# EAGLE schematic ledring_nocxn (EAGLE 6.4)
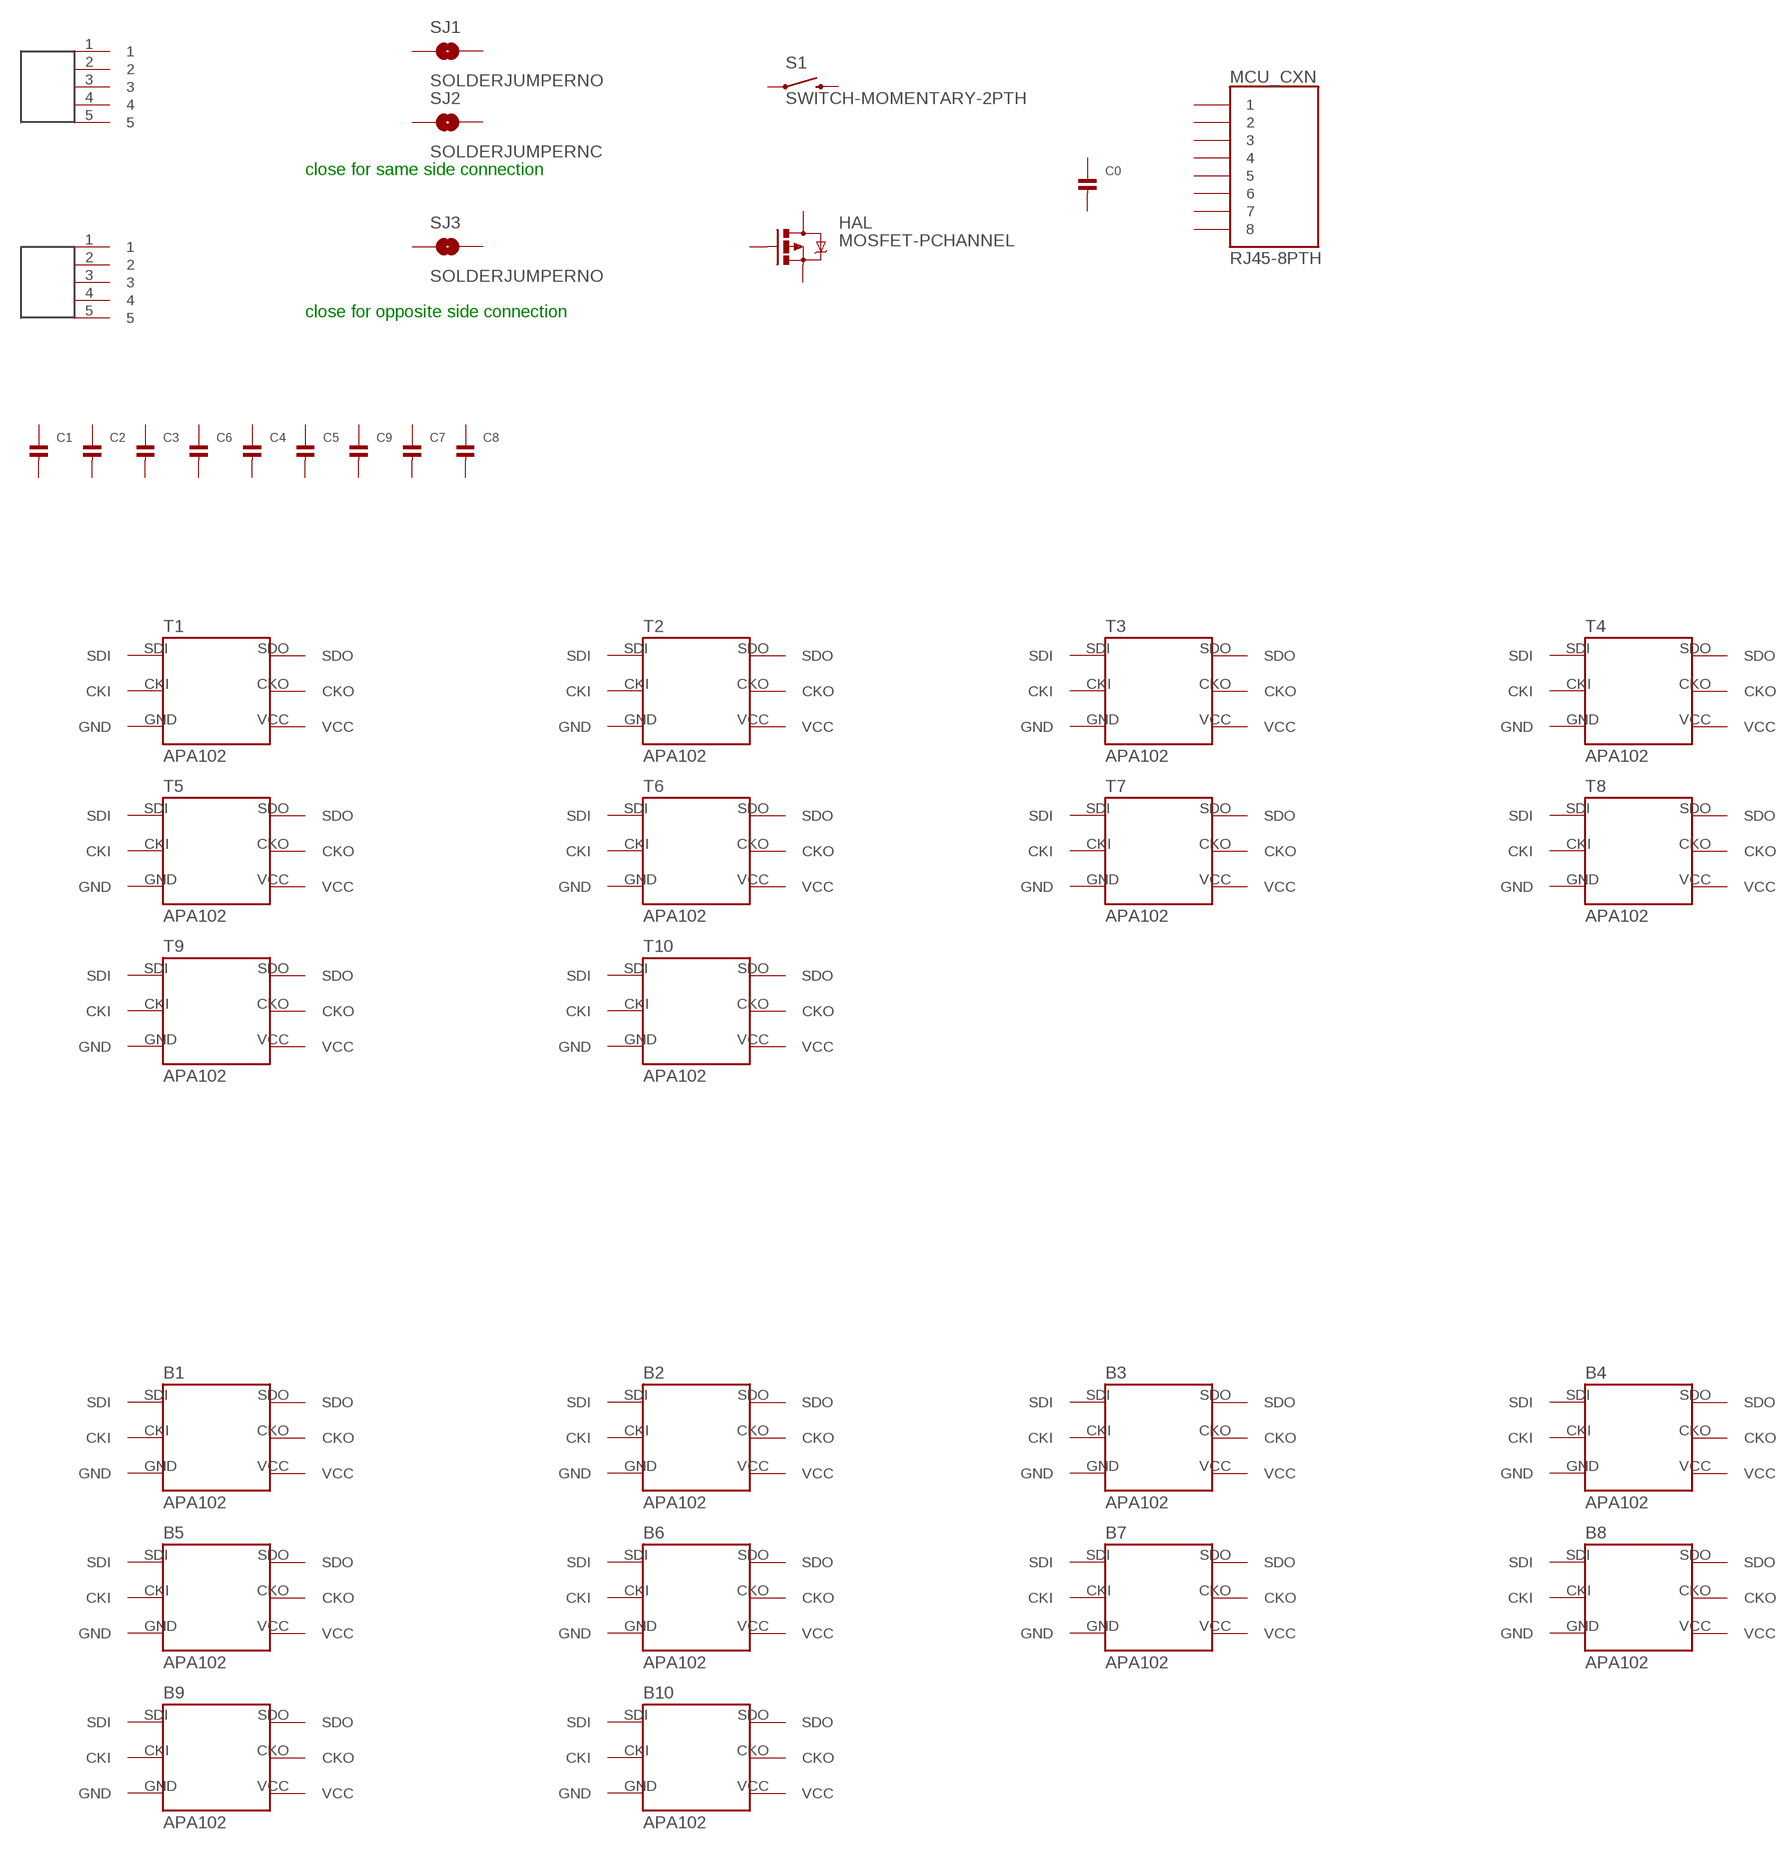
[diagram p0: schematic, sheet 1]

## Parts
B1  APA102  [APA102]
B2  APA102  [APA102]
B3  APA102  [APA102]
B4  APA102  [APA102]
B5  APA102  [APA102]
B6  APA102  [APA102]
B7  APA102  [APA102]
B8  APA102  [APA102]
B9  APA102  [APA102]
B10  APA102  [APA102]
C0  CAP_CERAMIC0805  [0805]
C1  CAP_CERAMIC0805  [0805]
C2  CAP_CERAMIC0805  [0805]
C3  CAP_CERAMIC0805  [0805]
C4  CAP_CERAMIC0805  [0805]
C5  CAP_CERAMIC0805  [0805]
C6  CAP_CERAMIC0805  [0805]
C7  CAP_CERAMIC0805  [0805]
C8  CAP_CERAMIC0805  [0805]
C9  CAP_CERAMIC0805  [0805]
HAL  MOSFET-PCHANNEL  [SOT23-3]
IN_CXN  LEDRINGPADS  [LEDRINGPADS]
MCU_CXN  RJ45-8PTH  [RJ45-8]
OUT_CXN  LEDRINGPADS  [LEDRINGPADS]
S1  SWITCH-MOMENTARY-2PTH  [TACTILE-PTH]
SJ1  SOLDERJUMPERNO  [SJ_2S-NO]
SJ2  SOLDERJUMPERNC  [SJ_2S]
SJ3  SOLDERJUMPERNO  [SJ_2S-NO]
T1  APA102  [APA102]
T2  APA102  [APA102]
T3  APA102  [APA102]
T4  APA102  [APA102]
T5  APA102  [APA102]
T6  APA102  [APA102]
T7  APA102  [APA102]
T8  APA102  [APA102]
T9  APA102  [APA102]
T10  APA102  [APA102]
Unconnected: B1.CKI B1.CKO B1.GND B1.SDI B1.SDO B1.VCC B2.CKI B2.CKO B2.GND B2.SDI B2.SDO B2.VCC B3.CKI B3.CKO B3.GND B3.SDI B3.SDO B3.VCC B4.CKI B4.CKO B4.GND B4.SDI B4.SDO B4.VCC B5.CKI B5.CKO B5.GND B5.SDI B5.SDO B5.VCC B6.CKI B6.CKO B6.GND B6.SDI B6.SDO B6.VCC B7.CKI B7.CKO B7.GND B7.SDI B7.SDO B7.VCC B8.CKI B8.CKO B8.GND B8.SDI B8.SDO B8.VCC B9.CKI B9.CKO B9.GND B9.SDI B9.SDO B9.VCC B10.CKI B10.CKO B10.GND B10.SDI B10.SDO B10.VCC C0.1 C0.2 C1.1 C1.2 C2.1 C2.2 C3.1 C3.2 C4.1 C4.2 C5.1 C5.2 C6.1 C6.2 C7.1 C7.2 C8.1 C8.2 C9.1 C9.2 HAL.1(G) HAL.2(S) HAL.3(D) IN_CXN.1 IN_CXN.2 IN_CXN.3 IN_CXN.4 IN_CXN.5 MCU_CXN.1 MCU_CXN.2 MCU_CXN.3 MCU_CXN.4 MCU_CXN.5 MCU_CXN.6 MCU_CXN.7 MCU_CXN.8 OUT_CXN.1 OUT_CXN.2 OUT_CXN.3 OUT_CXN.4 OUT_CXN.5 S1.1 S1.3 SJ1.1 SJ1.2 SJ2.1 SJ2.2 SJ3.1 SJ3.2 T1.CKI T1.CKO T1.GND T1.SDI T1.SDO T1.VCC T2.CKI T2.CKO T2.GND T2.SDI T2.SDO T2.VCC T3.CKI T3.CKO T3.GND T3.SDI T3.SDO T3.VCC T4.CKI T4.CKO T4.GND T4.SDI T4.SDO T4.VCC T5.CKI T5.CKO T5.GND T5.SDI T5.SDO T5.VCC T6.CKI T6.CKO T6.GND T6.SDI T6.SDO T6.VCC T7.CKI T7.CKO T7.GND T7.SDI T7.SDO T7.VCC T8.CKI T8.CKO T8.GND T8.SDI T8.SDO T8.VCC T9.CKI T9.CKO T9.GND T9.SDI T9.SDO T9.VCC T10.CKI T10.CKO T10.GND T10.SDI T10.SDO T10.VCC

## Notes on the sheet
- close for same side connection
- close for opposite side connection

## Library data of the parts
B1-B10 T1-T10 = SparkFun-LED:APA102
C0 C1-C9 = microbuilder:CAP_CERAMIC: Ceramic Capacitors 0402 - 0402 Surface Mount Capacitors 16pF 50V 5% [Digikey: 445-4899-2-ND] 18pF 50V 5% [Digikey: 490-1281-2-ND] 22pF 50V 5% [Digikey: 490-1283-2-ND] 68pF 50V 5% [Digikey: 490-1289-2-ND] 0.1uF 10V 10% [Digikey: 490-1318-2-ND] 1.0uF 6.3V 10% [Digikey: 490-1320-2-ND] 0603 - 0603 Surface Mount Capacitors 16 pF 50V 5% [Digikey: 445-5051-2-ND] 22 pF 50V [Digikey: PCC220ACVTR-ND] 33 pF 50V 5% [Digikey: 490-1415-1-ND] 56pF 50V 5% [Digikey: 490-1421-1-ND] 220pF 50V 5% [Digikey: 445-1285-1-ND] 680 pF 50V 2200 pF 50V 5% C0G [Digikey: 445-1297-1-ND] 5600 pF 100V 5% X7R [Digikey: 478-3711-1-ND] 0.1 µF 25V 10% [Digikey: PCC2277TR-ND] 0.22 µF 16V 10% X7R [Digikey: 445-1318-1-ND] 1.0 µF 25V 10% [Digikey: 445-5146-2-ND] 0603 - RF Specific 3pF 250V +/-0.1pF RF [Digikey: 712-1347-1-ND] 18 pF 250V 5% [Digikey: 478-3505-1-ND or 712-1322-1-ND] 56 pF 250V 5% C0G RF [Digikey: 490-4867-1-ND] 68 pF 250V RF [Digikey: 490-4868-1-ND] 0805 - 0805 Surface Mount Capacitors 220 pF 250V 2% RF Ceramic Capacitor [Digikey: 712-1398-1-ND] 1000 pF 50V 2% NP0 Ceramic Capacitor [Digikey: 478-3760-1-ND] 0.1 µF 25V 10% Ceramic Capacitor [Digikey: PCC1828TR-ND] 1.0 µF 16V 10% Ceramic Capacitor[Digikey: 490-1691-2-ND] 10.0 µF 10V 10% Ceramic Capacitor[Digikey: 709-1228-1-ND] 10.0 uF 16V 10% Ceramic Capacitor [Digikey: 478-5165-2-ND] 47 uF 6.3V 20% Ceramic Capacitor [Digikey: 587-1779-1-ND or 399-5506-1-ND] 1206 - 1206 Surface Mount Capacitors 47uF 10V 20% Ceramic Capacitor [Digikey: 490-5528-1-ND or 399-5508-1-ND or 445-6010-1-ND] 100uF 6.3V -20%, +80% Y5V Ceramic Capacitor (Digikey: 490-4512-1-ND, Mouser: 81-GRM31CF50J107ZE1L)
HAL = SparkFun-DiscreteSemi:MOSFET-PCHANNEL: Generic PMOSFET IRLML2244 - TRANS-11153 (SOT-23 -20V -4.3A) (1.Gate 2.Source 3.Drain) FQP27P06 - COM-10349 <http://www.sparkfun.com/products/10349> (TO-220 -60V -27A) (1.Gate 2.Source 3.Drain); PROD_ID: TRANS-08285
IN_CXN OUT_CXN = spencer:LEDRINGPADS
MCU_CXN = SparkFun-Connectors:RJ45-8: RJ45 Jack Simple RJ45, 8-pin connection - connector for common Cat5, Cat5e, and Cat6 Ethernet cables. Footprint not yet proven in production. Connector sku is PRT-00643; Breakout PCB sku is BOB-00716.
S1 = SparkFun-Electromechanical:SWITCH-MOMENTARY-2: Various NO switches- pushbuttons, reed, etc
SJ1-SJ3 = SparkFun-Retired:SOLDERJUMPER: Solder Jumper Standard SMD solder jumper. Used to automate production. Two varients : Normally Open and Normally Closed are the same, but have different paste layers. NC will have a large amount of paste and should jumper during reflow.

## Net classes
1 power: width 0.254 mm, drill 0.61 mm, clearance 0.254 mm
2 gnd: width 0.254 mm, drill 0.61 mm, clearance 0.254 mm
3 usbvcc: width 0.254 mm, drill 0.61 mm, clearance 0.254 mm
4 aref: width 0.254 mm, drill 0.61 mm, clearance 0.254 mm